# Altium schematic sheet schematic.SchDoc
size A4; SheetNumber: 6; SheetTotal: 29
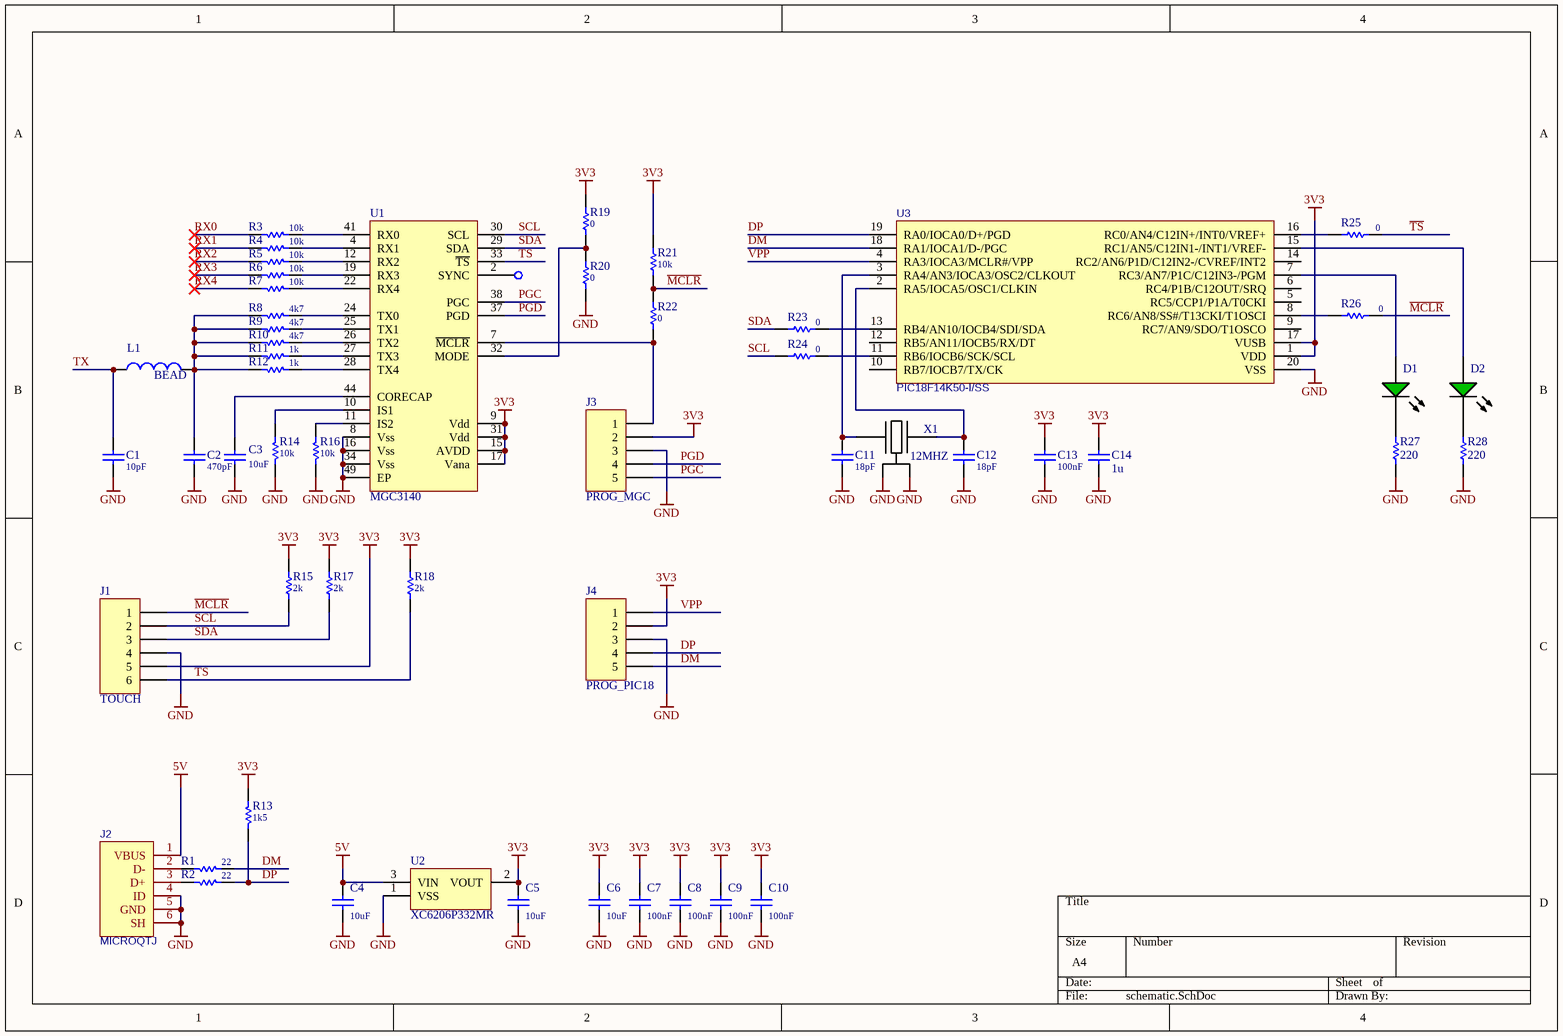
[diagram p0: schematic.SchDoc]

## Parts
C1  10pF  [C0603]
C2  470pF  [C0603]
C3  10uF  [C0805]
C4  10uF  [C1206]
C5  10uF  [C1206]
C6  10uF  [C0805]
C7  100nF  [C0402]
C8  100nF  [C0402]
C9  100nF  [C0402]
C10  100nF  [C0402]
C11  18pF  [C0402]
C12  18pF  [C0402]
C13  100nF  [C0402]
C14  1u  [C0603]
D1  GRN  [LED-0603-GRN]  (value not drawn)
D2  GRN  [LED-0603-GRN]  (value not drawn)
DN1  (no value)  [PAD_CAST2_0.8MM]  (no BOM)
J1  TOUCH  [HDR-1X6_2.54]  (no BOM)
J2  MICROQTJ  [CONN-USB-MICRO_#1]
J3  PROG_MGC  [HDR-1X5_2.54]  (no BOM)
J4  PROG_PIC18  [HDR-1X5_2.54]  (no BOM)
L1  BEAD  [L0603]
R1  22  [R0603]
R2  22  [R0603]
R3  10k  [R0603]
R4  10k  [R0603]
R5  10k  [R0603]
R6  10k  [R0603]
R7  10k  [R0603]
R8  4k7  [R0603]
R9  4k7  [R0603]
R10  4k7  [R0603]
R11  1k  [R0603]
R12  1k  [R0603]
R13  1k5  [R0603]
R14  10k  [R0402]
R15  2k  [R0402]
R16  10k  [R0402]
R17  2k  [R0402]
R18  2k  [R0603]
R19  0  [JMP0402_2]
R20  0  [JMP0402_2]
R21  10k  [R0603]
R22  0  [JMP0402_2]
R23  0  [JMP0402_2]
R24  0  [JMP0402_2]
R25  0  [JMP0402_2]
R26  0  [JMP0402_2]
R27  220  [R0603]
R28  220  [R0603]
U1  MGC3140  [QFN48_PT04_6X6]
U2  XC6206P332MR  [SOT-23]
U3  PIC18F14K50-I/SS  [SSOP-20]
X1  12MHZ  [CRYSTAL_3.2x2.5mm]

## Nets
3V3: C5.2 C6.2 C7.2 C8.2 C9.2 C10.2 C13.2 C14.2 J1.5 J3.2 J4.2 R13.2 R15.2 R17.2 R18.2 R19.1 R21.2 U1.9(Vdd) U1.15(AVDD) U1.17(Vana) U1.31(Vdd) U2.2(VOUT) U3.1(VDD) U3.17(VUSB)
5V: C4.2 J2.1(VBUS) U2.3(VIN)
GND: C1.1 C2.1 C3.1 C4.1 C5.1 C6.1 C7.1 C8.1 C9.1 C10.1 C11.1 C12.1 C13.1 C14.1 J1.4 J2.4(ID) J2.5(GND) J2.6(SH) J3.3 J4.3 R14.1 R16.1 R20.2 R27.1 R28.1 U1.8(Vss) U1.16(Vss) U1.34(Vss) U1.49(EP) U2.1(VSS) U3.20(VSS) X1.2(GND) X1.4(GND)
DM: J4.5 R1.2 U3.18(RA1/IOCA1/D-/PGC)
DP: J4.4 R2.2 R13.1 U3.19(RA0/IOCA0/D+/PGD)
~{MCLR}: J1.1 R21.1 R22.1 R26.1
PGC: J3.5 U1.38(PGC)
PGD: J3.4 U1.37(PGD)
RX0: R3.1
RX1: R4.1
RX2: R5.1
RX3: R6.1
RX4: R7.1
SCL: J1.2 R15.1 R24.2 U1.30(SCL)
SDA: J1.3 R17.1 R23.2 U1.29(SDA)
~{TS}: J1.6 R18.1 R25.1 U1.33(~{TS})
TX: C1.2 L1.2
VPP: J4.1 U3.4(RA3/IOCA3/MCLR#/VPP)
NetC2_2: C2.2 L1.1 R8.1 R9.1 R10.1 R11.1 R12.1
NetC3_2: C3.2 U1.44(CORECAP)
NetC11_2: C11.2 U3.3(RA4/AN3/IOCA3/OSC2/CLKOUT) X1.1(X1)
NetC12_2: C12.2 U3.2(RA5/IOCA5/OSC1/CLKIN) X1.3(X2)
NetD1_1: D1.1(A) U3.7(RC3/AN7/P1C/C12IN3-/PGM)
NetD1_2: D1.2(K) R27.2
NetD2_1: D2.1(A) U3.15(RC1/AN5/C12IN1-/INT1/VREF-)
NetD2_2: D2.2(K) R28.2
NetDN1_1: DN1.1 U1.2(SYNC)
NetJ2_2: J2.2(D-) R1.1
NetJ2_3: J2.3(D+) R2.1
NetJ3_1: J3.1 R22.2 U1.7(~{MCLR})
NetR3_2: R3.2 U1.41(RX0)
NetR4_2: R4.2 U1.4(RX1)
NetR5_2: R5.2 U1.12(RX2)
NetR6_2: R6.2 U1.19(RX3)
NetR7_2: R7.2 U1.22(RX4)
NetR8_2: R8.2 U1.24(TX0)
NetR9_2: R9.2 U1.25(TX1)
NetR10_2: R10.2 U1.26(TX2)
NetR11_2: R11.2 U1.27(TX3)
NetR12_2: R12.2 U1.28(TX4)
NetR14_2: R14.2 U1.10(IS1)
NetR16_2: R16.2 U1.11(IS2)
NetR19_2: R19.2 R20.1 U1.32(MODE)
NetR23_1: R23.1 U3.13(RB4/AN10/IOCB4/SDI/SDA)
NetR24_1: R24.1 U3.11(RB6/IOCB6/SCK/SCL)
NetR25_2: R25.2 U3.16(RC0/AN4/C12IN+/INT0/VREF+)
NetR26_2: R26.2 U3.8(RC6/AN8/SS#/T13CKI/T1OSCI)

Not connected (* = marked no-connect by the designer): U3 5(RC5/CCP1/P1A/T0CKI) 6(RC4/P1B/C12OUT/SRQ) 9(RC7/AN9/SDO/T1OSCO) 10(RB7/IOCB7/TX/CK) 12(RB5/AN11/IOCB5/RX/DT) 14(RC2/AN6/P1D/C12IN2-/CVREF/INT2)

## Library data of the parts
C1-C10 C13 = CAP
C11 C12 = CAP: 18pF 50V 0402; P/N: GRM1555C1H180JA01D; LCSC part number: C33149
C14 = Cap
D1 D2 = LED-0603-GREEN: LED 0603 GRN
DN1 = dummy net
J1 = Header 3
J3 J4 = Header 5
L1 = BLM18AG601SN1D: 380mΩ ±25% 600Ω@100MHz 0603 Ferrite Beads; LCSC part number: C19330; P/N: BLM18AG601SN1D
R1 R2 R14-R26 = RES
R3-R7 = RES: 10k 0603
R8-R10 = RES: 4k7 0603
R11 R12 = RES: 1k 0603
R13 = RES: 1k5 0603
R27 R28 = Res1
U1 = Component_1_1
U2 = Component_4_1
X1 = CRYSTAL 12MHZ 3.20mm x 2.50mm: CRYSTAL 12MHZ 10PF SMD; P/N: X322512MOB4SI; LCSC part number: C70565
U3 = PIC18F14K50-I/SS: LCSC part number: C12460; P/N: PIC18F14K50-I/SS